# EAGLE schematic Jasmine (EAGLE 7.7.0)
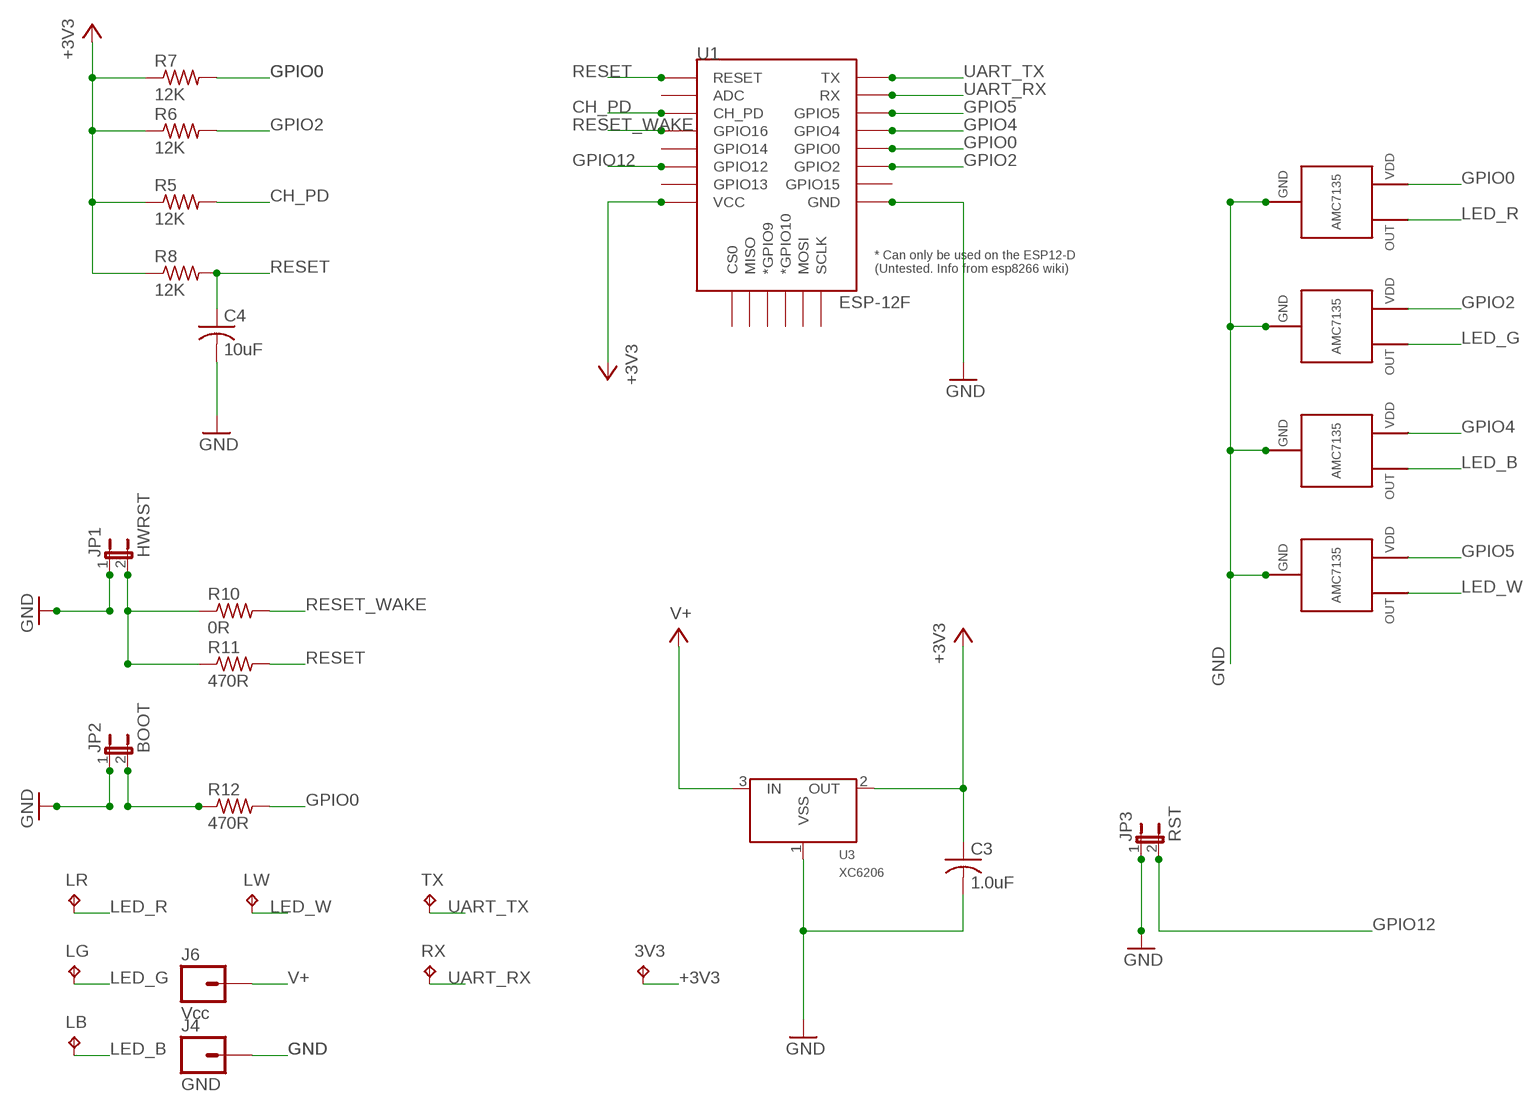
[diagram p0: schematic, sheet 1]

## Parts
3V3  TPB2,54  [B2,54]
C3  1.0uF  C-USC0805K  [C0805K]
C4  10uF  C-USC0805  [C0805]
J4  GND  M01PTH_2MM  [1X01_2MM]
J6  Vcc  M01PTH_2MM  [1X01_2MM]
JP1  HWRST  JUMPER-2SMD-NO  [SJ_2S-NO]
JP2  BOOT  JUMPER-2SMD-NO  [SJ_2S-NO]
JP3  RST  JUMPER-2SMD-NO  [SJ_2S-NO]
LB  TPB2,54  [B2,54]
LG  TPB2,54  [B2,54]
LR  TPB2,54  [B2,54]
LW  TPB2,54  [B2,54]
R5  12K  R-US_R0805  [R0805]
R6  12K  R-US_R0805  [R0805]
R7  12K  R-US_R0805  [R0805]
R8  12K  R-US_R0805  [R0805]
R10  0R  R-US_R0805  [R0805]
R11  470R  R-US_R0805  [R0805]
R12  470R  R-US_R0805  [R0805]
RX  TPB2,54  [B2,54]
TX  TPB2,54  [B2,54]
U1  ESP-12F  ESP12ESMD  [ESP12E-SMD]
U3  XC6206  XC6206SOT-23  [XC6206_SOT-23]
U$1  AMC7135_CC_REGULATOR  [AMC7135_CC_REGULATOR]
U$2  AMC7135_CC_REGULATOR  [AMC7135_CC_REGULATOR]
U$3  AMC7135_CC_REGULATOR  [AMC7135_CC_REGULATOR]
U$4  AMC7135_CC_REGULATOR  [AMC7135_CC_REGULATOR]

## Nets
+3V3: 3V3.TP C3.1 R5.1 R6.1 R7.1 R8.1 U1.VCC U3.2(OUT)
CH_PD: R5.2 U1.CH_PD
GND: C3.2 C4.2 J4.1 JP1.1 JP2.1 JP3.1 U1.GND U3.1(VSS) U$1.GND2(GND) U$1.GND3(GND) U$2.GND2(GND) U$2.GND3(GND) U$3.GND2(GND) U$3.GND3(GND) U$4.GND2(GND) U$4.GND3(GND)
GPIO0: R7.2 R12.2 U1.GPIO0 U$2.VDD
GPIO2: R6.2 U1.GPIO2 U$1.VDD
GPIO4: U1.GPIO4 U$3.VDD
GPIO5: U1.GPIO5 U$4.VDD
GPIO12: JP3.2 U1.GPIO12
JMP_BLDR: JP2.2 R12.1
JMP_RESET: JP1.2 R10.1 R11.1
LED_B: LB.TP U$3.OUT
LED_G: LG.TP U$1.OUT
LED_R: LR.TP U$2.OUT
LED_W: LW.TP U$4.OUT
RESET: C4.1 R8.2 R11.2 U1.RESET
RESET_WAKE: R10.2 U1.GPIO16
UART_RX: RX.TP U1.RXD0(RX)
UART_TX: TX.TP U1.TXD0(TX)
V+: J6.1 U3.3(IN)
Unconnected: U1.ADC U1.CS0 U1.GPIO9(*GPIO9) U1.GPIO10(*GPIO10) U1.GPIO13 U1.GPIO14 U1.GPIO15 U1.MISO U1.MOSI U1.SCLK

## Library data of the parts
3V3 LB LG LR LW RX TX = testpad:TP: Test pad
C3 C4 = resistor:C-US: CAPACITOR, American symbol
J4 J6 = SparkFun-Connectors:M01: Header 1 Standard 1-pin 0.1" header. Use with straight break away headers (SKU : PRT-00116), right angle break away headers (PRT-00553), swiss pins (PRT-00743), machine pins (PRT-00117), and female headers (PRT-00115). SMTSO-256-ET is a "flush mount" nut for a 4-40 screw. The older package used to be too tight, and did not allow it to sit properly thru the drill hit. The latest (0.165DIA) fits nice and snug.
JP1-JP3 = SparkFun-Retired:JUMPER-2: Jumper Basic 0.1" spaced jumper. Use with breakaway headers.
R5-R8 R10-R12 = adafruit:R-US_: RESISTOR, American symbol
U1 = esp8266modules:ESP12E: ESP12E Module
U3 = Voltage Regulator:XC6206: XC6206P , linear regulator. Producted by TOREX.Co Store Information: EXCEL device corporation http://www.excel-d.com/access/index.html
U$1-U$4 = AMC7135_CC_Regulator:AMC7135_CC_REGULATOR